# EAGLE design Hreidmar (EAGLE 5.10)
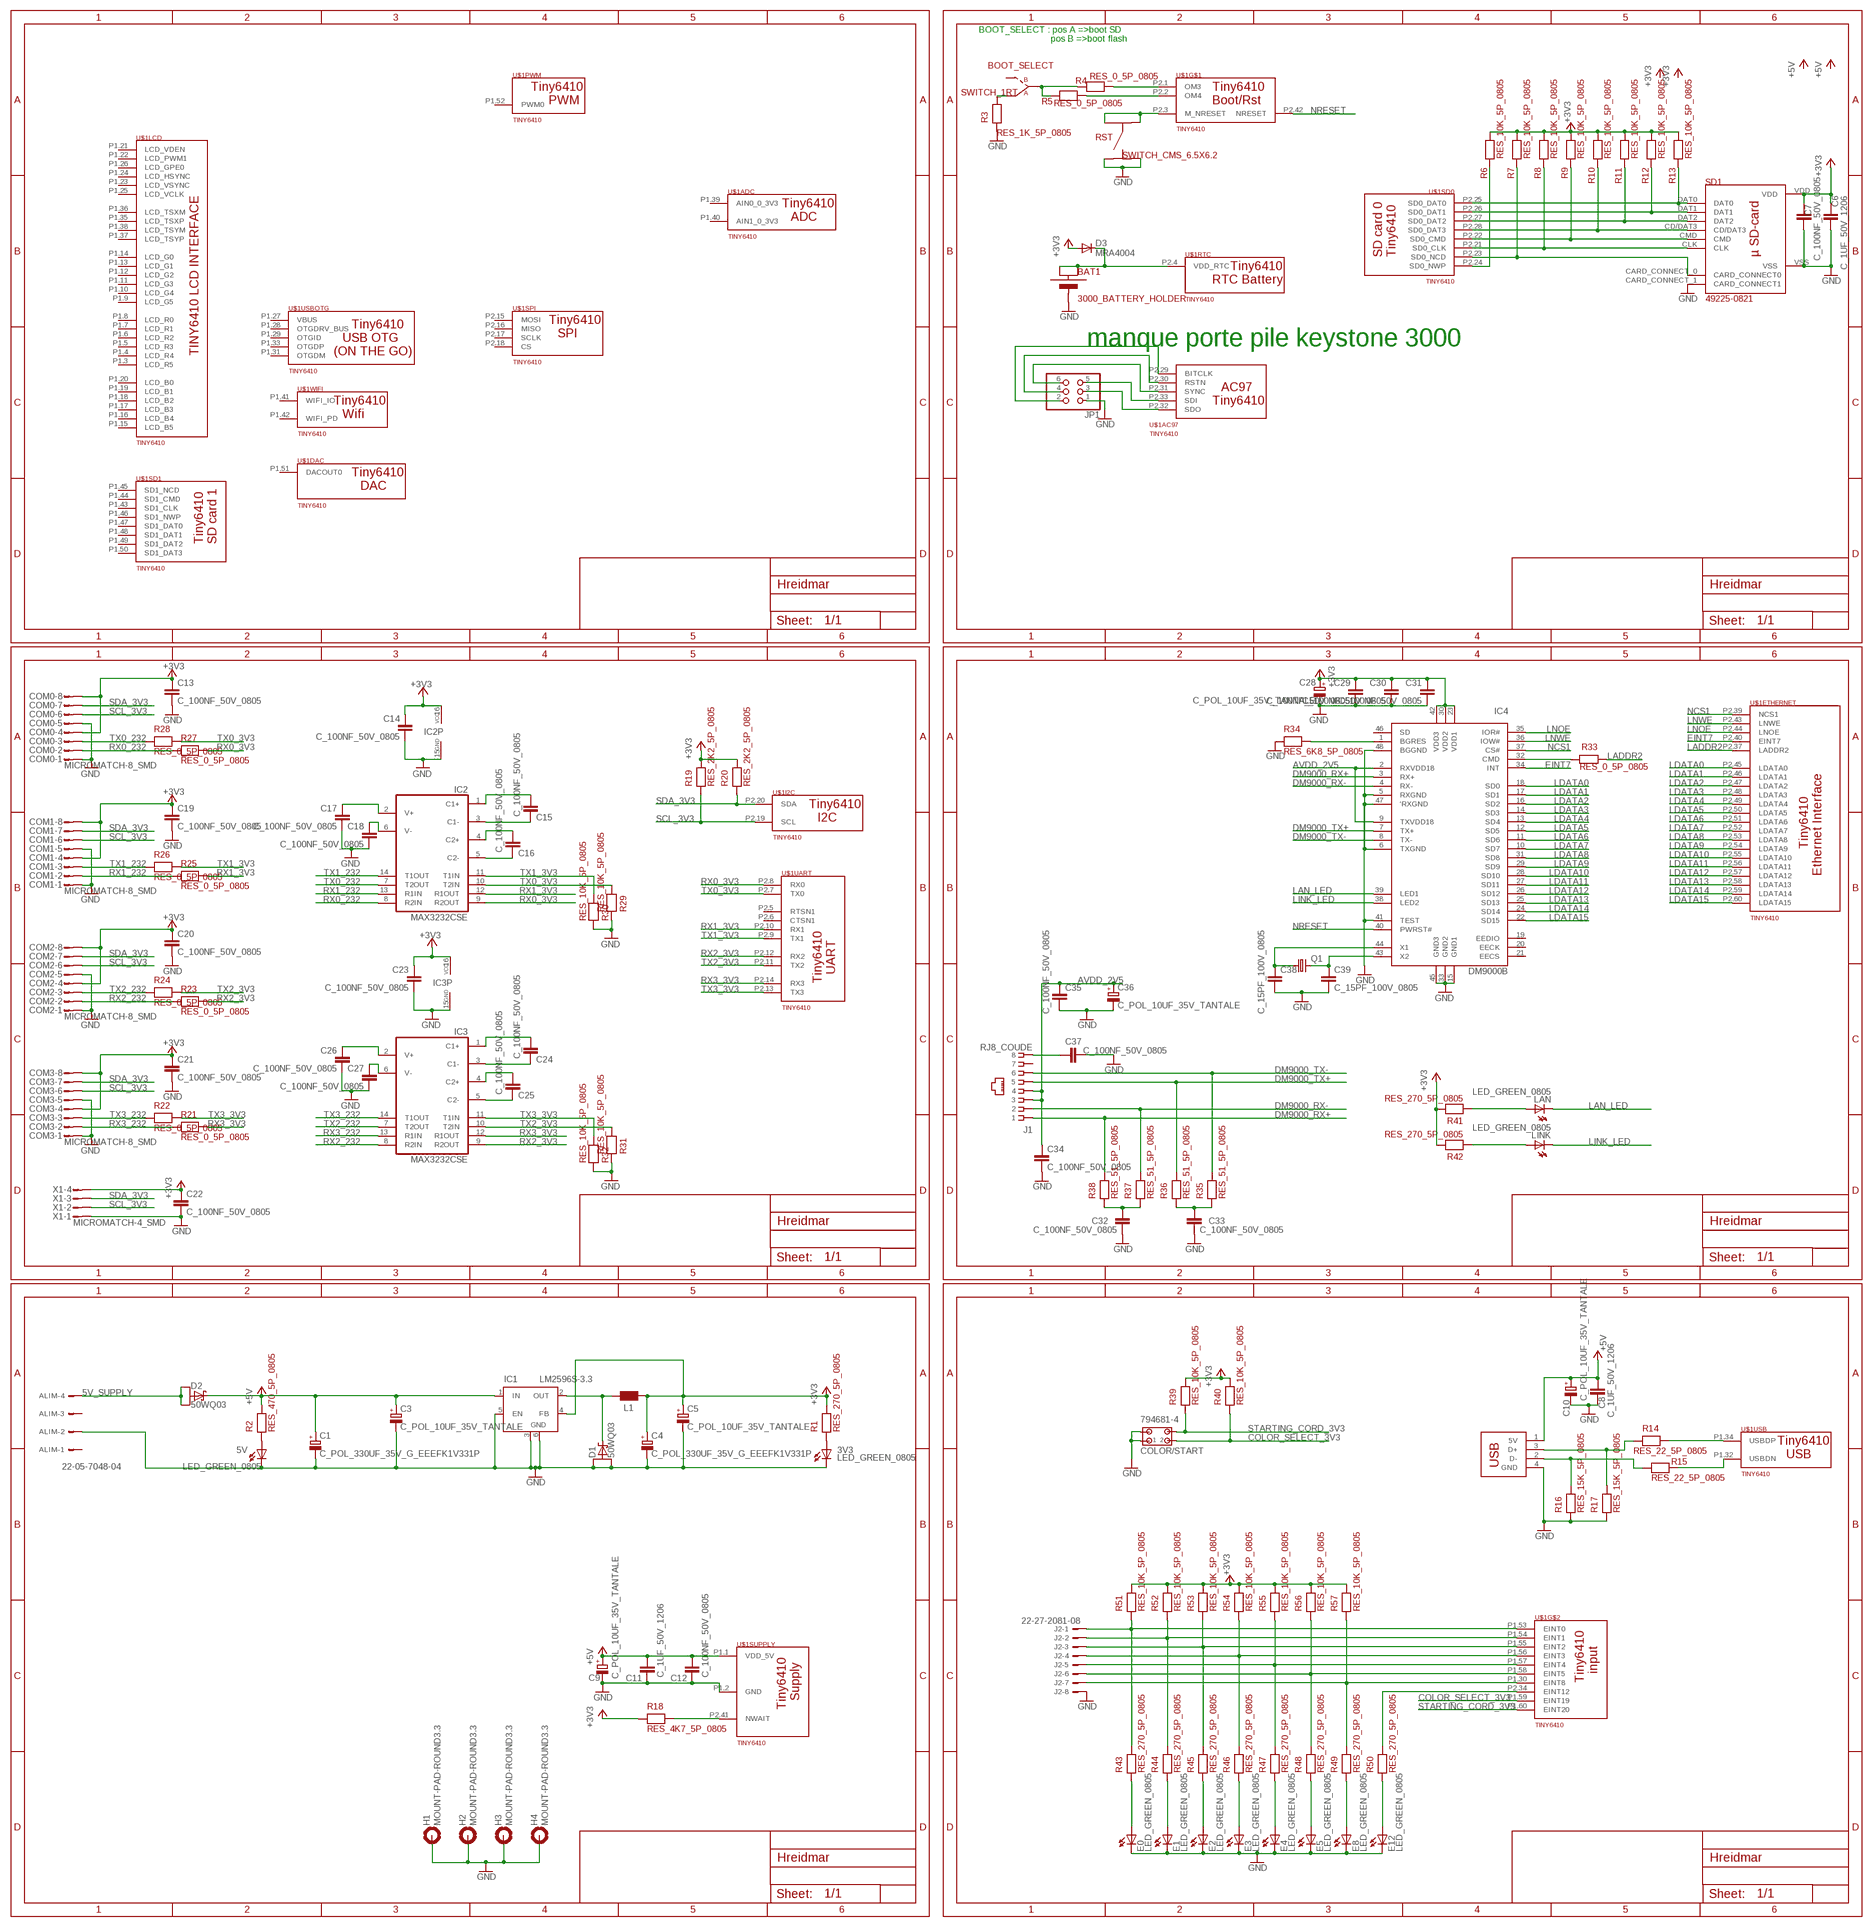
[diagram p0: schematic, sheet 1]

## Parts
3V3  LED_GREEN_0805  [CHIP-LED0805]
5V  LED_GREEN_0805  [CHIP-LED0805]
ALIM  22-05-7048-04  [7395-04]
BAT1  3000_BATTERY_HOLDER  [3000_BATTERY]
BOOT_SELECT  SWITCH_1RT  [SWITCH_1RT]
C1  C_POL_330UF_35V_G_EEEFK1V331P  [PANASONIC_G]
C3  C_POL_10UF_35V_TANTALE  [SMC_D]
C4  C_POL_330UF_35V_G_EEEFK1V331P  [PANASONIC_G]
C5  C_POL_10UF_35V_TANTALE  [SMC_D]
C6  C_1UF_50V_1206  [C1206]
C7  C_100NF_50V_0805  [C0805]
C8  C_1UF_50V_1206  [C1206]
C9  C_POL_10UF_35V_TANTALE  [SMC_D]
C10  C_POL_10UF_35V_TANTALE  [SMC_D]
C11  C_1UF_50V_1206  [C1206]
C12  C_100NF_50V_0805  [C0805]
C13  C_100NF_50V_0805  [C0805]
C14  C_100NF_50V_0805  [C0805]
C15  C_100NF_50V_0805  [C0805]
C16  C_100NF_50V_0805  [C0805]
C17  C_100NF_50V_0805  [C0805]
C18  C_100NF_50V_0805  [C0805]
C19  C_100NF_50V_0805  [C0805]
C20  C_100NF_50V_0805  [C0805]
C21  C_100NF_50V_0805  [C0805]
C22  C_100NF_50V_0805  [C0805]
C23  C_100NF_50V_0805  [C0805]
C24  C_100NF_50V_0805  [C0805]
C25  C_100NF_50V_0805  [C0805]
C26  C_100NF_50V_0805  [C0805]
C27  C_100NF_50V_0805  [C0805]
C28  C_POL_10UF_35V_TANTALE  [SMC_D]
C29  C_100NF_50V_0805  [C0805]
C30  C_100NF_50V_0805  [C0805]
C31  C_100NF_50V_0805  [C0805]
C32  C_100NF_50V_0805  [C0805]
C33  C_100NF_50V_0805  [C0805]
C34  C_100NF_50V_0805  [C0805]
C35  C_100NF_50V_0805  [C0805]
C36  C_POL_10UF_35V_TANTALE  [SMC_D]
C37  C_100NF_50V_0805  [C0805]
C38  C_15PF_100V_0805  [C0805]
C39  C_15PF_100V_0805  [C0805]
COLOR/START  794681-4  [794681-4]
COM0  MICROMATCH-8_SMD  [MICROMATCH-8_SMD]
COM1  MICROMATCH-8_SMD  [MICROMATCH-8_SMD]
COM2  MICROMATCH-8_SMD  [MICROMATCH-8_SMD]
COM3  MICROMATCH-8_SMD  [MICROMATCH-8_SMD]
D1  50WQ03  [TO252]
D2  50WQ03  [TO252]
D3  MRA4004  DIODE-DO-214AC  [DO-214AC]
E0  LED_GREEN_0805  [CHIP-LED0805]
E1  LED_GREEN_0805  [CHIP-LED0805]
E2  LED_GREEN_0805  [CHIP-LED0805]
E3  LED_GREEN_0805  [CHIP-LED0805]
E4  LED_GREEN_0805  [CHIP-LED0805]
E5  LED_GREEN_0805  [CHIP-LED0805]
E8  LED_GREEN_0805  [CHIP-LED0805]
E12  LED_GREEN_0805  [CHIP-LED0805]
H1  MOUNT-PAD-ROUND3.3  [3,3-PAD]
H2  MOUNT-PAD-ROUND3.3  [3,3-PAD]
H3  MOUNT-PAD-ROUND3.3  [3,3-PAD]
H4  MOUNT-PAD-ROUND3.3  [3,3-PAD]
IC1  LM2596S-3.3  [TO263-5]
IC2  MAX3232CSE  [SO16]
IC3  MAX3232CSE  [SO16]
IC4  DM9000B  [TQFP48]
J1  RJ8_COUDE  [6605759-1]
J2  22-27-2081-08  [6410-08]
JP1  PINHD-2X3  [2X03]
L1  L_22UH_XXL_7447709220  [WE-PD_L/XL/XXL]
LAN  LED_GREEN_0805  [CHIP-LED0805]
LINK  LED_GREEN_0805  [CHIP-LED0805]
Q1  CRYSTAL_25MHZ_HC49UP  [HC49UP]
R1  RES_270_5P_0805  [R0805]
R2  RES_470_5P_0805  [R0805]
R3  RES_1K_5P_0805  [R0805]
R4  RES_0_5P_0805  [R0805]
R5  RES_0_5P_0805  [R0805]
R6  RES_10K_5P_0805  [R0805]
R7  RES_10K_5P_0805  [R0805]
R8  RES_10K_5P_0805  [R0805]
R9  RES_10K_5P_0805  [R0805]
R10  RES_10K_5P_0805  [R0805]
R11  RES_10K_5P_0805  [R0805]
R12  RES_10K_5P_0805  [R0805]
R13  RES_10K_5P_0805  [R0805]
R14  RES_22_5P_0805  [R0805]
R15  RES_22_5P_0805  [R0805]
R16  RES_15K_5P_0805  [R0805]
R17  RES_15K_5P_0805  [R0805]
R18  RES_4K7_5P_0805  [R0603]
R19  RES_2K2_5P_0805  [R0805]
R20  RES_2K2_5P_0805  [R0805]
R21  RES_0_5P_0805  [R0805]
R22  RES_0_5P_0805  [R0805]
R23  RES_0_5P_0805  [R0805]
R24  RES_0_5P_0805  [R0805]
R25  RES_0_5P_0805  [R0805]
R26  RES_0_5P_0805  [R0805]
R27  RES_0_5P_0805  [R0805]
R28  RES_0_5P_0805  [R0805]
R29  RES_10K_5P_0805  [R0805]
R30  RES_10K_5P_0805  [R0805]
R31  RES_10K_5P_0805  [R0805]
R32  RES_10K_5P_0805  [R0805]
R33  RES_0_5P_0805  [R0805]
R34  RES_6K8_5P_0805  [R0805]
R35  RES_51_5P_0805  [R0805]
R36  RES_51_5P_0805  [R0805]
R37  RES_51_5P_0805  [R0805]
R38  RES_51_5P_0805  [R0805]
R39  RES_10K_5P_0805  [R0805]
R40  RES_10K_5P_0805  [R0805]
R41  RES_270_5P_0805  [R0805]
R42  RES_270_5P_0805  [R0805]
R43  RES_270_5P_0805  [R0805]
R44  RES_270_5P_0805  [R0805]
R45  RES_270_5P_0805  [R0805]
R46  RES_270_5P_0805  [R0805]
R47  RES_270_5P_0805  [R0805]
R48  RES_270_5P_0805  [R0805]
R49  RES_270_5P_0805  [R0805]
R50  RES_270_5P_0805  [R0805]
R51  RES_10K_5P_0805  [R0805]
R52  RES_10K_5P_0805  [R0805]
R53  RES_10K_5P_0805  [R0805]
R54  RES_10K_5P_0805  [R0805]
R55  RES_10K_5P_0805  [R0805]
R56  RES_10K_5P_0805  [R0805]
R57  RES_10K_5P_0805  [R0805]
RST  SWITCH_CMS_6.5X6.2  [SWITCH_B3SL]
SD1  49225-0821  [49225-0821]
U$1  TINY6410  [TINY6410]
U$2  USB_A  [USB_A_RIGHT_ANGLE]
X1  MICROMATCH-4_SMD  [MICROMATCH-4_SMD]

## Nets
5V_SUPPLY: ALIM.4 D2.1(A1) D2.3(A2)
+3V3: C4.+ C5.+ C6.1 C7.1 C13.1 C14.1 C19.1 C20.1 C21.1 C22.1 C23.1 C28.+ C29.1 C30.1 C31.1 COM0.4 COM0.8 COM1.4 COM1.8 COM2.4 COM2.8 COM3.4 COM3.8 D3.A IC1.4(FB) IC2.16(VCC) IC3.16(VCC) IC4.23(VDD1) IC4.30(VDD2) IC4.42(VDD3) L1.2 R1.2 R6.2 R7.2 R8.2 R9.2 R10.2 R11.2 R12.2 R13.2 R18.1 R19.2 R20.2 R39.2 R40.2 R41.2 R42.2 R51.2 R52.2 R53.2 R54.2 R55.2 R56.2 R57.2 SD1.VDD X1.4
+5V: C1.+ C3.+ C8.1 C9.+ C10.+ C11.1 C12.1 D2.4(C) IC1.1(IN) R2.2 U$1.P1.1(SUPPLY:VDD_5V) U$2.1(5V)
AVDD_2V5: C34.1 C35.1 C36.+ IC4.2(RXVDD18) IC4.9(TXVDD18) J1.3 J1.4
COLOR_SELECT_3V3: COLOR/START.2 R40.1 U$1.P1.59(EINT19)
DM9000_RX+: IC4.3(RX+) J1.1 R38.2
DM9000_RX-: IC4.4(RX-) J1.2 R37.2
DM9000_TX+: IC4.7(TX+) J1.5 R36.2
DM9000_TX-: IC4.8(TX-) J1.6 R35.2
EINT7: IC4.34(INT) U$1.P2.40(ETHERNET:EINT7)
GND: 3V3.C 5V.C ALIM.2 BAT1.- C1.- C3.- C4.- C5.- C6.2 C7.2 C8.2 C9.- C10.- C11.2 C12.2 C13.2 C14.2 C17.2 C18.2 C19.2 C20.2 C21.2 C22.2 C23.2 C26.2 C27.2 C28.- C29.2 C30.2 C31.2 C32.2 C33.2 C34.2 C35.2 C36.- C37.2 C38.2 C39.2 COLOR/START.1 COLOR/START.3 COM0.1 COM0.5 COM1.1 COM1.5 COM2.1 COM2.5 COM3.1 COM3.5 D1.1(A1) D1.3(A2) E0.C E1.C E2.C E3.C E4.C E5.C E8.C E12.C H1.B3,3(MOUNT) H2.B3,3(MOUNT) H3.B3,3(MOUNT) H4.B3,3(MOUNT) IC1.3(GND) IC1.5(EN) IC1.6(GND) IC2.15(GND) IC3.15(GND) IC4.5(RXGND) IC4.6(TXGND) IC4.15(GND1) IC4.33(GND2) IC4.41(TEST) IC4.45(GND3) IC4.47('RXGND) IC4.48(BGGND) J2.8 JP1.1 R3.1 R16.1 R17.1 R29.1 R30.1 R31.1 R32.1 R34.1 RST.1 RST.2 SD1.CARD_CONNECT_1(CARD_CONNECT1) SD1.VSS U$1.P1.2(SUPPLY:GND) U$2.4(GND) X1.1
LADDR2: R33.1 U$1.P2.37(ETHERNET:LADDR2)
LAN_LED: IC4.39(LED1) LAN.C
LDATA0: IC4.18(SD0) U$1.P2.45(ETHERNET:LDATA0)
LDATA1: IC4.17(SD1) U$1.P2.46(ETHERNET:LDATA1)
LDATA2: IC4.16(SD2) U$1.P2.47(ETHERNET:LDATA2)
LDATA3: IC4.14(SD3) U$1.P2.48(ETHERNET:LDATA3)
LDATA4: IC4.13(SD4) U$1.P2.49(ETHERNET:LDATA4)
LDATA5: IC4.12(SD5) U$1.P2.50(ETHERNET:LDATA5)
LDATA6: IC4.11(SD6) U$1.P2.51(ETHERNET:LDATA6)
LDATA7: IC4.10(SD7) U$1.P2.52(ETHERNET:LDATA7)
LDATA8: IC4.31(SD8) U$1.P2.53(ETHERNET:LDATA8)
LDATA9: IC4.29(SD9) U$1.P2.54(ETHERNET:LDATA9)
LDATA10: IC4.28(SD10) U$1.P2.55(ETHERNET:LDATA10)
LDATA11: IC4.27(SD11) U$1.P2.56(ETHERNET:LDATA11)
LDATA12: IC4.26(SD12) U$1.P2.57(ETHERNET:LDATA12)
LDATA13: IC4.25(SD13) U$1.P2.58(ETHERNET:LDATA13)
LDATA14: IC4.24(SD14) U$1.P2.59(ETHERNET:LDATA14)
LDATA15: IC4.22(SD15) U$1.P2.60(ETHERNET:LDATA15)
LINK_LED: IC4.38(LED2) LINK.C
LNOE: IC4.35(IOR#) U$1.P2.44(ETHERNET:LNOE)
LNWE: IC4.36(IOW#) U$1.P2.43(ETHERNET:LNWE)
N$1: RST.3 RST.4 U$1.P2.3(M_NRESET)
N$2: 3V3.A R1.1
N$3: 5V.A R2.1
N$4: BOOT_SELECT.3 R3.2
N$5: R5.2 U$1.P2.2(OM4)
N$6: R4.2 U$1.P2.1(OM3)
N$7: BOOT_SELECT.1 R4.1 R5.1
N$8: R13.1 SD1.DAT0 U$1.P2.25(SD0:SD0_DAT0)
N$9: R12.1 SD1.DAT1 U$1.P2.26(SD0:SD0_DAT1)
N$10: D1.4(C) IC1.2(OUT) L1.1
N$11: R11.1 SD1.DAT2 U$1.P2.27(SD0:SD0_DAT2)
N$12: R10.1 SD1.CD/DAT3 U$1.P2.28(SD0:SD0_DAT3)
N$13: R9.1 SD1.CMD U$1.P2.22(SD0:SD0_CMD)
N$14: R8.1 SD1.CLK U$1.P2.21(SD0:SD0_CLK)
N$15: R7.1 SD1.CARD_CONNECT_0(CARD_CONNECT0) U$1.P2.23(SD0:SD0_NCD)
N$16: R6.1 U$1.P2.24(SD0:SD0_NWP)
N$17: R15.1 R16.2 U$2.2(D-)
N$18: R14.1 R17.2 U$2.3(D+)
N$19: R14.2 U$1.P1.34(USB:USBDP)
N$20: C15.1 IC2.1(C1+)
N$21: R18.2 U$1.P2.41(SUPPLY:NWAIT)
N$22: C15.2 IC2.3(C1-)
N$23: C16.1 IC2.4(C2+)
N$24: C16.2 IC2.5(C2-)
N$25: C18.1 IC2.6(V-)
N$26: C17.1 IC2.2(V+)
N$27: C24.1 IC3.1(C1+)
N$28: C24.2 IC3.3(C1-)
N$29: C25.1 IC3.4(C2+)
N$30: C25.2 IC3.5(C2-)
N$31: C26.1 IC3.2(V+)
N$32: C27.1 IC3.6(V-)
N$33: IC4.32(CMD) R33.2
N$34: IC4.1(BGRES) R34.2
N$35: C32.1 R37.1 R38.1
N$36: C33.1 R35.1 R36.1
N$37: C39.1 IC4.43(X2) Q1.2
N$38: C38.1 IC4.44(X1) Q1.1
N$39: LAN.A R41.1
N$40: LINK.A R42.1
N$41: JP1.3 U$1.P2.32(AC97:SDO)
N$42: C37.1 J1.8
N$43: BAT1.'+ BAT1.+ D3.C U$1.P2.4(RTC:VDD_RTC)
N$44: E0.A R43.1
N$45: E1.A R44.1
N$46: E2.A R45.1
N$47: E3.A R46.1
N$48: E4.A R47.1
N$49: E5.A R48.1
N$50: E8.A R49.1
N$51: E12.A R50.1
N$52: R50.2 U$1.P2.34(EINT12)
N$53: J2.7 R49.2 R57.1 U$1.P1.30(EINT8)
N$54: J2.6 R48.2 R56.1 U$1.P1.58(EINT5)
N$55: J2.5 R47.2 R55.1 U$1.P1.57(EINT4)
N$56: J2.4 R46.2 R54.1 U$1.P1.56(EINT3)
N$57: J2.3 R45.2 R53.1 U$1.P1.55(EINT2)
N$58: J2.2 R44.2 R52.1 U$1.P1.54(EINT1)
N$59: J2.1 R43.2 R51.1 U$1.P1.53(EINT0)
N$60: JP1.5 U$1.P2.33(AC97:SDI)
N$61: JP1.6 U$1.P2.31(AC97:SYNC)
N$62: JP1.4 U$1.P2.30(AC97:RSTN)
N$63: JP1.2 U$1.P2.29(AC97:BITCLK)
NCS1: IC4.37(CS#) U$1.P2.39(ETHERNET:NCS1)
NRESET: IC4.40(PWRST#) U$1.P2.42(NRESET)
RX0_3V3: IC2.9(R2OUT) R27.2 U$1.P2.8(UART:RX0)
RX0_232: COM0.2 IC2.8(R2IN) R27.1
RX1_3V3: IC2.12(R1OUT) R25.2 U$1.P2.10(UART:RX1)
RX1_232: COM1.2 IC2.13(R1IN) R25.1
RX2_3V3: IC3.9(R2OUT) R23.2 U$1.P2.12(UART:RX2)
RX2_232: COM2.2 IC3.8(R2IN) R23.1
RX3_3V3: IC3.12(R1OUT) R21.2 U$1.P2.14(UART:RX3)
RX3_232: COM3.2 IC3.13(R1IN) R21.1
SCL_3V3: COM0.6 COM1.6 COM2.6 COM3.6 R19.1 U$1.P2.19(I2C:SCL) X1.2
SDA_3V3: COM0.7 COM1.7 COM2.7 COM3.7 R20.1 U$1.P2.20(I2C:SDA) X1.3
STARTING_CORD_3V3: COLOR/START.4 R39.1 U$1.P1.60(EINT20)
TX0_3V3: IC2.10(T2IN) R28.2 R29.2 U$1.P2.7(UART:TX0)
TX0_232: COM0.3 IC2.7(T2OUT) R28.1
TX1_3V3: IC2.11(T1IN) R26.2 R30.2 U$1.P2.9(UART:TX1)
TX1_232: COM1.3 IC2.14(T1OUT) R26.1
TX2_3V3: IC3.10(T2IN) R24.2 R31.2 U$1.P2.11(UART:TX2)
TX2_232: COM2.3 IC3.7(T2OUT) R24.1
TX3_3V3: IC3.11(T1IN) R22.2 R32.2 U$1.P2.13(UART:TX3)
TX3_232: COM3.3 IC3.14(T1OUT) R22.1
USBDN: R15.2 U$1.P1.32(USB:USBDN)
Unconnected: ALIM.1 ALIM.3 BOOT_SELECT.2 IC4.19(EEDIO) IC4.20(EECK) IC4.21(EECS) IC4.46(SD) J1.7 U$1.P1.3(LCD:LCD_R5) U$1.P1.4(LCD:LCD_R4) U$1.P1.5(LCD:LCD_R3) U$1.P1.6(LCD:LCD_R2) U$1.P1.7(LCD:LCD_R1) U$1.P1.8(LCD:LCD_R0) U$1.P1.9(LCD:LCD_G5) U$1.P1.10(LCD:LCD_G4) U$1.P1.11(LCD:LCD_G3) U$1.P1.12(LCD:LCD_G2) U$1.P1.13(LCD:LCD_G1) U$1.P1.14(LCD:LCD_G0) U$1.P1.15(LCD:LCD_B5) U$1.P1.16(LCD:LCD_B4) U$1.P1.17(LCD:LCD_B3) U$1.P1.18(LCD:LCD_B2) U$1.P1.19(LCD:LCD_B1) U$1.P1.20(LCD:LCD_B0) U$1.P1.21(LCD:LCD_VDEN) U$1.P1.22(LCD:LCD_PWM1) U$1.P1.23(LCD:LCD_VSYNC) U$1.P1.24(LCD:LCD_HSYNC) U$1.P1.25(LCD:LCD_VCLK) U$1.P1.26(LCD:LCD_GPE0) U$1.P1.27(USBOTG:VBUS) U$1.P1.28(USBOTG:OTGDRV_BUS) U$1.P1.29(USBOTG:OTGID) U$1.P1.31(USBOTG:OTGDM) U$1.P1.33(USBOTG:OTGDP) U$1.P1.35(LCD:LCD_TSXP) U$1.P1.36(LCD:LCD_TSXM) U$1.P1.37(LCD:LCD_TSYP) U$1.P1.38(LCD:LCD_TSYM) U$1.P1.39(ADC:AIN0_0_3V3) U$1.P1.40(ADC:AIN1_0_3V3) U$1.P1.41(WIFI:WIFI_IO) U$1.P1.42(WIFI:WIFI_PD) U$1.P1.43(SD1:SD1_CLK) U$1.P1.44(SD1:SD1_CMD) U$1.P1.45(SD1:SD1_NCD) U$1.P1.46(SD1:SD1_NWP) U$1.P1.47(SD1:SD1_DAT0) U$1.P1.48(SD1:SD1_DAT1) U$1.P1.49(SD1:SD1_DAT2) U$1.P1.50(SD1:SD1_DAT3) U$1.P1.51(DAC:DACOUT0) U$1.P1.52(PWM:PWM0) U$1.P2.5(UART:RTSN1) U$1.P2.6(UART:CTSN1) U$1.P2.15(SPI:MOSI) U$1.P2.16(SPI:MISO) U$1.P2.17(SPI:SCLK) U$1.P2.18(SPI:CS)

## Notes on the sheet
- BOOT_SELECT : pos A =>boot SD
- pos B =>boot flash
- manque porte pile keystone 3000

## Library data of the parts
3V3 5V E0 E1-E5 E8 E12 LAN LINK = robotter_diode:LED_
ALIM = con-molex:22-?-04: CONNECTOR wire to board 2.54 mm (.1 inch) pitch header
BAT1 = robotter_others:3000_BATTERY_HOLDER
BOOT_SELECT = robotter_others:SWITCH_1RT
C1 C4 = robotter_capacitor:C_POL_; VALUE: 330UF_35V_G_EEEFK1V331P
C3 C5 C9 C10 C28 C36 = robotter_capacitor:C_POL_; VALUE: 10uF_35V_TANTALE
C6-C8 C11-C27 C29-C35 C37-C39 = robotter_capacitor:C_
COLOR/START = con-amp:794681-4: Micro MATE-N-LOK Connectors grid 1.5mm Dual Row Through Hole Vertical Metal Through Hole Holddowns Source: ENG_CD_794681_E.pdf
COM0 COM1-COM3 = robotter_connector:MICROMATCH-8_SMD: Ref FN : 1865096
D1 D2 = robotter_diode:50WQ03
D3 = diode:DIODE-: DIODE
H1-H4 = holes:MOUNT-PAD-ROUND: MOUNTING PAD, round
IC1 = robotter_ic:LM2596S: STEP-DOWN VOLTAGE REGULATOR
IC2 IC3 = robotter_ic:MAX3232: True RS-232 Transceivers 3.0V to 5.5V, Low-Power up to 1Mbps, Using Four 0.1µF External Capacitors Source: http://pdfserv.maxim-ic.com/en/ds/MAX3222-MAX3241.pdf
IC4 = robotter_ic:DM9000B: MAC/PHY Ethernet 10/100 16bits mode pinout
J1 = robotter_connector:RJ8_COUDE
J2 = con-molex:22-?-08: CONNECTOR wire to board 2.54 mm (.1 inch) pitch header
JP1 = pinhead:PINHD-2X3: PIN HEADER
L1 = robotter_inductor:L_: SMD-Shielded Power Inductors WE-PD Is recommended for the application with switching regulators from National Semiconductor, Linear Technology, Texas Instruments and Fairchild Semiconductor - Magnetically shielded version which results in a low leakage field - High storage capacity - Low self-losses -- Switching regulators with low operating voltages (computer, laptop, mobile phones, pagers) -- Integrated DC/DC-converter; VALUE: 22UH_XXL_7447709220
Q1 = robotter_ic:CRYSTAL_: CRYSTAL
R1-R57 = robotter_resistor:RES_
RST = robotter_others:SWITCH_CMS_6.5X6.2
SD1 = robotter_connector:49225-0821
U$1 = robotter_others:TINY6410
U$2 = robotter_connector:USB_A
X1 = robotter_connector:MICROMATCH-4_SMD: Ref FN : 1865094

## Board
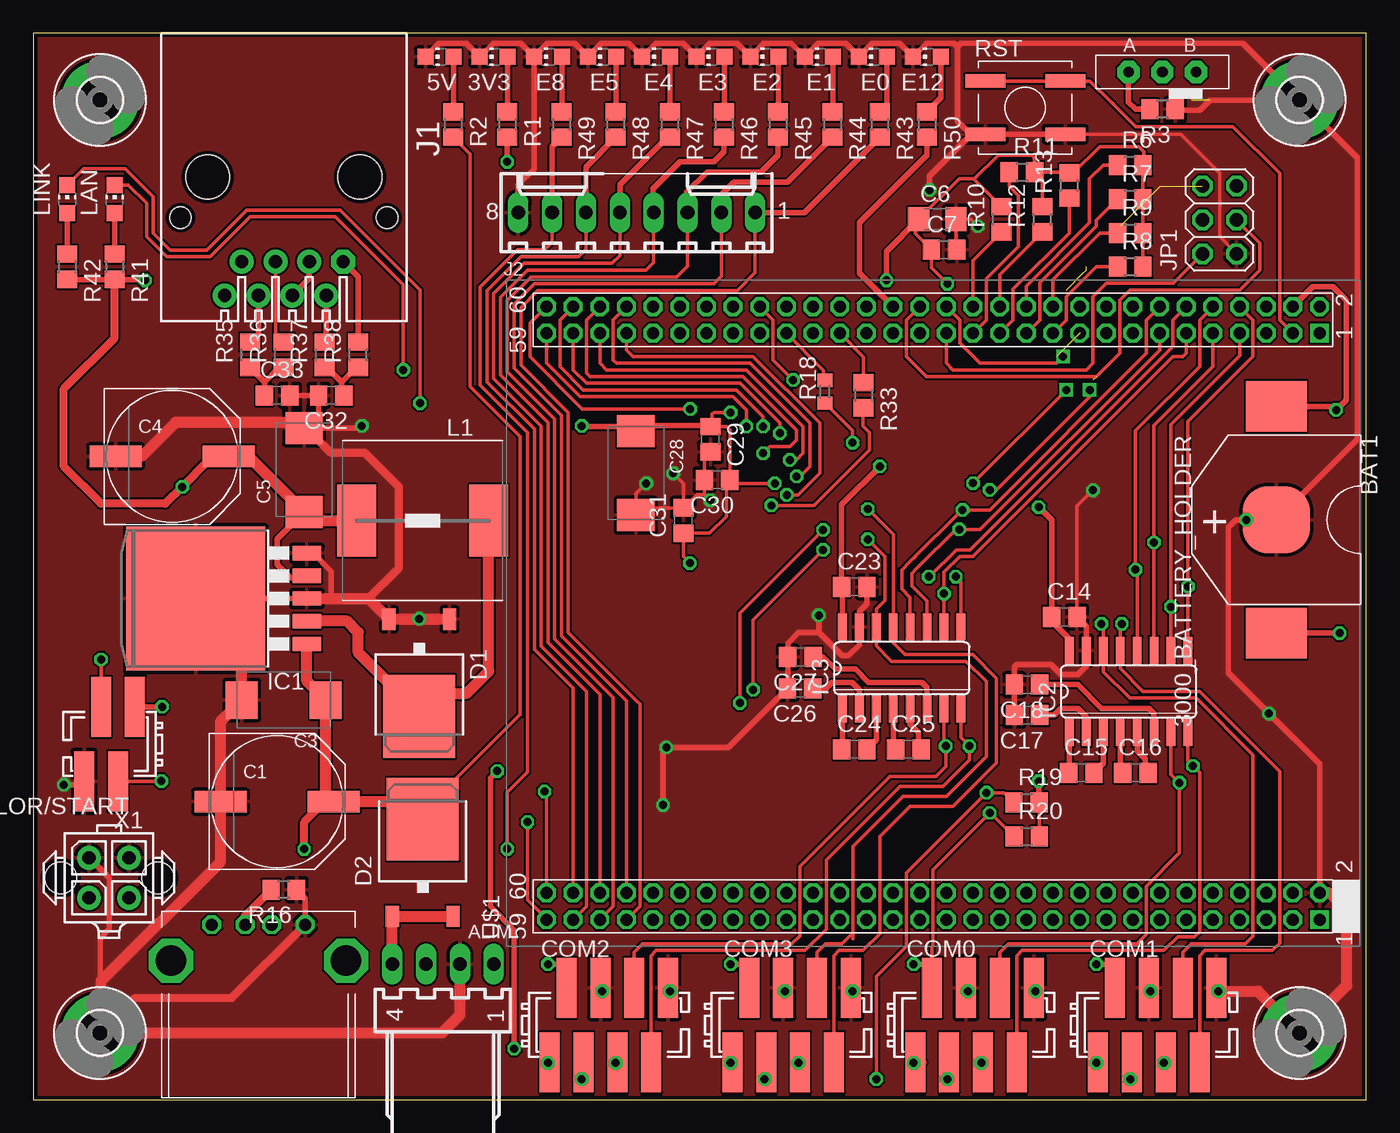
[diagram p1: board, top side]
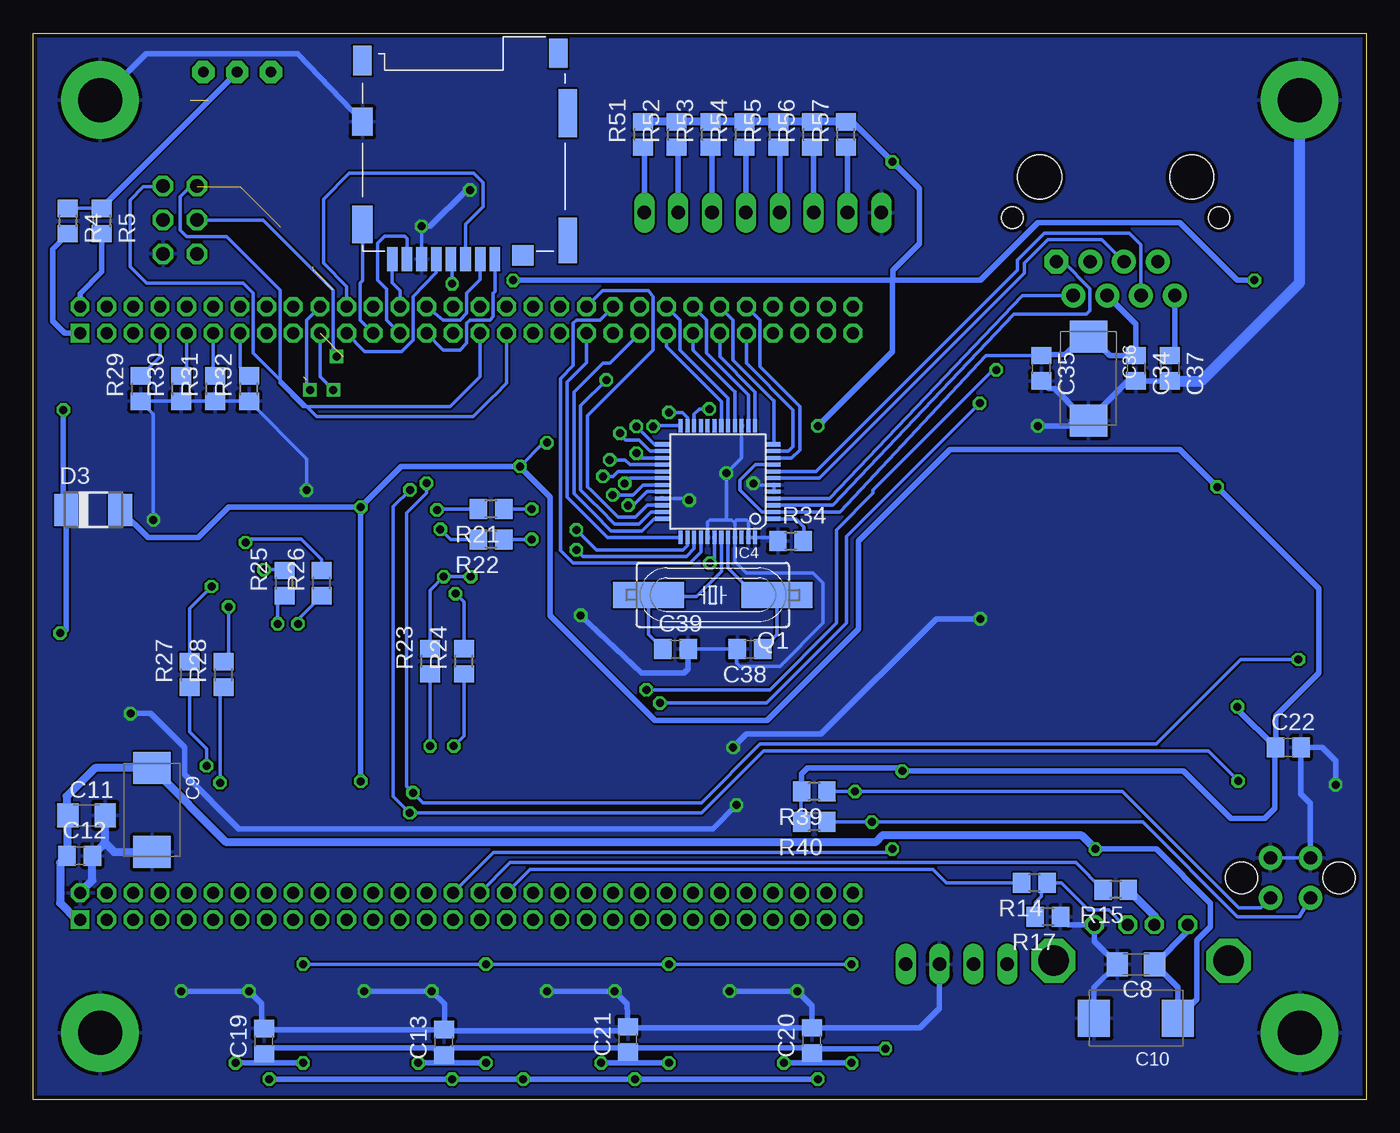
[diagram p2: board, bottom side, seen from below]

Size 100 x 80 mm. Coordinates in mm from the lower left corner, seen from the top.
Outline: 0,0 100,0 100,80 0,80 0,0
Copper layers (1*16): Top 0.035mm / dielectric 1.5mm / Bottom 0.035mm
Design rules "default *": minimum track width 10mil, minimum drill 0.3mm, track to track 0.15mm, track to pad 0.15mm, pad to pad 0.15mm, via to via 0.15mm, smd to smd 8mil, copper to edge 0.3mm, drill to drill 8mil, minimum pad ring 10mil, minimum via ring 8mil, stop-mask expansion 4mil, vias tented up to drill 0mil, thermal gap 10mil

### Footprints (pad centres in the part's own frame; a part is rotated, then mirrored left to right if it is on the bottom)
CHIP-LED0805 = smd 1.2 x 1.2: A 0,-1.05; C 0,1.05
7395-04 = drill 1.016 long: 1 3.81,0; 2 1.27,0; 3 -1.27,0; 4 -3.81,0
3000_BATTERY = smd 3.81 x 4.572: '+ -8.509,0; + 8.509,0 | smd 5.08 x 5.08: - 0,0
SWITCH_1RT = drill 0.8 pad 1.676 octagon: 1 0,0; 2 -2.54,0; 3 2.54,0
PANASONIC_G = smd 3.9 x 1.6: + 4.25,0; - -4.25,0
SMC_D = smd 2.4 x 2.8: + -3.15,0; - 3.15,0
C1206 = smd 1.6 x 1.8: 1 -1.4,0; 2 1.4,0
C0805 = smd 1.3 x 1.5: 1 -0.95,0; 2 0.95,0
794681-4 = drill 1 pad 1.778 round: 1 1.5,-1.5; 2 1.5,1.5; 3 -1.5,-1.5; 4 -1.5,1.5 | hole 2.4: 3.63,0; -3.67,0
MICROMATCH-8_SMD = smd 1.5 x 4.5: 1 4.445,2.794; 2 3.175,-2.794; 3 1.905,2.794; 4 0.635,-2.794; 5 -0.635,2.794; 6 -1.905,-2.794; 7 -3.175,2.794; 8 -4.445,-2.794
TO252 = smd 1 x 1.6: 1 -2.28,-4.8; 3 2.28,-4.8 | smd 5.4 x 6.2: 4 0,2.5
DO-214AC = smd 1.8 x 2.4: A 2.025,0; C -2.025,0
3,3-PAD = drill 3.3 pad 5.842 round: B3,3 0,0
TO263-5 = smd 1.067 x 2.159: 1 -3.404,-5.791; 2 -1.702,-5.791; 3 0,-5.791; 4 1.702,-5.791; 5 3.404,-5.791 | smd 10.8 x 10.41: 6 0,2.54
SO16 = smd 0.66 x 2.032: 1 -4.445,-3.073; 2 -3.175,-3.073; 3 -1.905,-3.073; 4 -0.635,-3.073; 5 0.635,-3.073; 6 1.905,-3.073; 7 3.175,-3.073; 8 4.445,-3.073; 9 4.445,3.073; 10 3.175,3.073; 11 1.905,3.073; 12 0.635,3.073; 13 -0.635,3.073; 14 -1.905,3.073; 15 -3.175,3.073; 16 -4.445,3.073
TQFP48 = smd 1.016 x 0.305: 1 -4.191,2.794; 2 -4.191,2.286; 3 -4.191,1.778; 4 -4.191,1.27; 5 -4.191,0.762; 6 -4.191,0.254; 7 -4.191,-0.254; 8 -4.191,-0.762; 9 -4.191,-1.27; 10 -4.191,-1.778; 11 -4.191,-2.286; 12 -4.191,-2.794; 25 4.191,-2.794; 26 4.191,-2.286; 27 4.191,-1.778; 28 4.191,-1.27; 29 4.191,-0.762; 30 4.191,-0.254; 31 4.191,0.254; 32 4.191,0.762; 33 4.191,1.27; 34 4.191,1.778; 35 4.191,2.286; 36 4.191,2.794 | smd 0.305 x 1.016: 13 -2.794,-4.191; 14 -2.286,-4.191; 15 -1.778,-4.191; 16 -1.27,-4.191; 17 -0.762,-4.191; 18 -0.254,-4.191; 19 0.254,-4.191; 20 0.762,-4.191; 21 1.27,-4.191; 22 1.778,-4.191; 23 2.286,-4.191; 24 2.794,-4.191; 37 2.794,4.191; 38 2.286,4.191; 39 1.778,4.191; 40 1.27,4.191; 41 0.762,4.191; 42 0.254,4.191; 43 -0.254,4.191; 44 -0.762,4.191; 45 -1.27,4.191; 46 -1.778,4.191; 47 -2.286,4.191; 48 -2.794,4.191
6605759-1 = drill 1 pad 1.8 octagon: 1 -4.45,6.35 | drill 1 pad 1.8 round: 2 -3.18,8.89; 3 -1.91,6.35; 4 -0.63,8.89; 5 0.63,6.35; 6 1.9,8.89; 7 3.17,6.35; 8 4.44,8.89 | hole 3.3: -5.715,0; 5.715,0 | hole 1.6: -7.747,3.048; 7.747,3.048
6410-08 = drill 1.016 long: 1 8.89,0; 2 6.35,0; 3 3.81,0; 4 1.27,0; 5 -1.27,0; 6 -3.81,0; 7 -6.35,0; 8 -8.89,0
2X03 = drill 1.016 octagon: 1 -2.54,-1.27; 2 -2.54,1.27; 3 0,-1.27; 4 0,1.27; 5 2.54,-1.27; 6 2.54,1.27
WE-PD_L/XL/XXL = smd 2.9 x 5.4: 1 -4.95,0; 2 4.95,0
HC49UP = smd 5.334 x 1.93: 1 -4.826,0; 2 4.826,0
R0805 = smd 1.3 x 1.5: 1 -0.95,0; 2 0.95,0
R0603 = smd 1 x 1.1: 1 -0.85,0; 2 0.85,0
SWITCH_B3SL = smd 3 x 1: 1 3,-2; 2 -3,-2; 3 3,2; 4 -3,2
49225-0821 = smd 1.55 x 2.8: CARD_CONNECT_0 6.73,14.1 | smd 1.55 x 2.1: CARD_CONNECT_1 6.73,6.4 | smd 0.8 x 1.8: CD/DAT3 -2.11,16.7; CLK 1.19,16.7; CMD -1.01,16.7; DAT0 3.39,16.7; DAT1 4.49,16.7; DAT2 -3.21,16.7; VDD 0.09,16.7; VSS 2.29,16.7 | smd 1.4 x 2.2: P$3 6.73,1.8; P$4 -7.97,1.25 | smd 1.4 x 3.6: P$5 -8.67,5.75 | smd 1.4 x 3.4: P$6 -8.67,15.3 | smd 1.6 x 1.55: P$7 -5.31,16.425
TINY6410 = drill 0.9 pad 1.422 square: P1.1 -23,-29; P2.1 21,-29 | drill 0.9 pad 1.422 octagon: P1.2 -21,-29; P1.3 -23,-27; P1.4 -21,-27; P1.5 -23,-25; P1.6 -21,-25; P1.7 -23,-23; P1.8 -21,-23; P1.9 -23,-21; P1.10 -21,-21; P1.11 -23,-19; P1.12 -21,-19; P1.13 -23,-17; P1.14 -21,-17; P1.15 -23,-15; P1.16 -21,-15; P1.17 -23,-13; P1.18 -21,-13; P1.19 -23,-11; P1.20 -21,-11; P1.21 -23,-9; P1.22 -21,-9; P1.23 -23,-7; P1.24 -21,-7; P1.25 -23,-5; P1.26 -21,-5; P1.27 -23,-3; P1.28 -21,-3; P1.29 -23,-1; P1.30 -21,-1; P1.31 -23,1; P1.32 -21,1; P1.33 -23,3; P1.34 -21,3; P1.35 -23,5; P1.36 -21,5; P1.37 -23,7; P1.38 -21,7; P1.39 -23,9; P1.40 -21,9; P1.41 -23,11; P1.42 -21,11; P1.43 -23,13; P1.44 -21,13; P1.45 -23,15; P1.46 -21,15; P1.47 -23,17; P1.48 -21,17; P1.49 -23,19; P1.50 -21,19; P1.51 -23,21; P1.52 -21,21; P1.53 -23,23; P1.54 -21,23; P1.55 -23,25; P1.56 -21,25; P1.57 -23,27; P1.58 -21,27; P1.59 -23,29; P1.60 -21,29; P2.2 23,-29; P2.3 21,-27; P2.4 23,-27; P2.5 21,-25; P2.6 23,-25; P2.7 21,-23; P2.8 23,-23; P2.9 21,-21; P2.10 23,-21; P2.11 21,-19; P2.12 23,-19; P2.13 21,-17; P2.14 23,-17; P2.15 21,-15; P2.16 23,-15; P2.17 21,-13; P2.18 23,-13; P2.19 21,-11; P2.20 23,-11; P2.21 21,-9; P2.22 23,-9; P2.23 21,-7; P2.24 23,-7; P2.25 21,-5; P2.26 23,-5; P2.27 21,-3; P2.28 23,-3; P2.29 21,-1; P2.30 23,-1; P2.31 21,1; P2.32 23,1; P2.33 21,3; P2.34 23,3; P2.35 21,5; P2.36 23,5; P2.37 21,7; P2.38 23,7; P2.39 21,9; P2.40 23,9; P2.41 21,11; P2.42 23,11; P2.43 21,13; P2.44 23,13; P2.45 21,15; P2.46 23,15; P2.47 21,17; P2.48 23,17; P2.49 21,19; P2.50 23,19; P2.51 21,21; P2.52 23,21; P2.53 21,23; P2.54 23,23; P2.55 21,25; P2.56 23,25; P2.57 21,27; P2.58 23,27; P2.59 21,29; P2.60 23,29
USB_A_RIGHT_ANGLE = drill 0.9 octagon: 1 -3.5,2.71; 2 -1,2.71; 3 1,2.71; 4 3.5,2.71 | drill 2.3 octagon: CASE -6.57,0; CASE1 6.57,0
MICROMATCH-4_SMD = smd 1.5 x 4.5: 1 1.905,2.794; 2 0.635,-2.794; 3 -0.635,2.794; 4 -1.905,-2.794

### Placement (x,y rotation side)
3V3  34.54,78.23 90 top
5V  30.48,78.23 90 top
ALIM  30.73,10.16 0 top
BAT1  93.25,43.5 270 top
BOOT_SELECT  84.71,77.09 180 top
C1  18.29,22.35 0 top
C3  18.8,29.97 180 top
C4  10.41,48.26 0 top
C5  20.32,47.24 90 top
C6  67.82,66.04 0 top
C7  68.33,63.75 0 top
C8  17.27,10.16 180 bottom
C9  91.1,21.73 270 bottom
C10  17.27,6.1 180 bottom
C11  96.01,21.34 0 bottom
C12  96.52,18.29 0 bottom
C13  69.19,4.3 90 bottom
C14  77.35,36.21 0 top
C15  78.62,24.52 0 top
C16  82.69,24.52 0 top
C17  74.56,28.84 180 top
C18  74.56,31.13 180 top
C19  82.69,4.38 90 bottom
C20  41.59,4.43 90 bottom
C21  55.39,4.51 90 bottom
C22  5.84,26.42 0 bottom
C23  61.6,38.47 0 top
C24  61.6,26.27 0 top
C25  65.66,26.27 0 top
C26  57.53,30.85 180 top
C27  57.55,33.21 180 top
C28  45.21,47 270 top
C29  50.8,49.54 270 top
C30  51.31,46.49 180 top
C31  48.77,43.45 90 top
C32  22.35,52.83 180 top
C33  18.29,52.83 0 top
C34  17.27,54.86 270 bottom
C35  24.38,54.86 270 bottom
C36  20.83,54.1 270 bottom
C37  14.73,54.86 270 bottom
C38  46.23,33.79 180 bottom
C39  51.82,33.79 0 bottom
COLOR/START  5.68,16.64 180 top
COM0  70.61,5.59 0 top
COM1  84.33,5.59 0 top
COM2  43.18,5.59 0 top
COM3  56.9,5.59 0 top
D1  28.96,31.24 180 top
D2  29.21,18.54 0 top
D3  95.5,44.25 0 bottom
E0  62.99,78.23 90 top
E1  58.93,78.23 90 top
E2  54.86,78.23 90 top
E3  50.8,78.23 90 top
E4  46.74,78.23 90 top
E5  42.67,78.23 90 top
E8  38.61,78.23 90 top
E12  67.06,78.23 90 top
H1  5,5 0 top
H2  5,75 0 top
H3  95,75 0 top
H4  95,5 0 top
IC1  14.73,37.59 90 top
IC2  82.18,30.62 0 top
IC3  65.15,32.37 0 top
IC4  48.64,46.37 180 bottom
J1  18.8,69.22 180 top
J2  45.27,66.55 0 top
JP1  89,66 90 top
L1  29.21,43.43 180 top
LAN  6.1,67.56 0 top
LINK  2.54,67.56 0 top
Q1  49.02,37.86 180 bottom
R1  35.56,73.15 270 top
R2  31.5,73.15 270 top
R3  84.71,74.29 180 top
R4  97.41,65.91 270 bottom
R5  94.87,65.91 270 bottom
R6  82.3,70.1 0 top
R7  82.3,67.56 0 top
R8  82.3,62.48 0 top
R9  82.3,65.02 0 top
R10  72.64,66.04 90 top
R11  74.17,69.6 0 top
R12  75.69,66.04 90 top
R13  77.72,68.58 90 top
R14  24.89,16.26 180 bottom
R15  18.8,15.75 180 bottom
R16  18.8,15.75 180 top
R17  23.88,13.72 180 bottom
R18  59.39,53.11 90 top
R19  74.52,22.29 0 top
R20  74.53,19.74 0 top
R21  65.66,44.31 180 bottom
R22  65.66,42.02 180 bottom
R23  70.23,32.88 90 bottom
R24  67.69,32.88 90 bottom
R25  81.16,38.75 90 bottom
R26  78.37,38.75 90 bottom
R27  88.27,31.89 90 bottom
R28  85.73,31.89 90 bottom
R29  91.95,53.34 90 bottom
R30  88.9,53.34 90 bottom
R31  86.36,53.34 90 bottom
R32  83.82,53.34 90 bottom
R33  62.29,52.85 270 top
R34  43.18,41.92 0 bottom
R35  16.26,55.88 90 top
R36  18.8,55.88 90 top
R37  21.84,55.88 90 top
R38  24.38,55.88 90 top
R39  41.4,23.11 180 bottom
R40  41.4,20.83 180 bottom
R41  6.1,62.48 270 top
R42  2.54,62.48 270 top
R43  63.5,73.15 270 top
R44  59.94,73.15 270 top
R45  55.88,73.15 270 top
R46  51.82,73.15 270 top
R47  47.75,73.15 270 top
R48  43.69,73.15 270 top
R49  39.62,73.15 270 top
R50  67.06,73.15 270 top
R51  54.27,72.4 90 bottom
R52  51.73,72.4 90 bottom
R53  49.19,72.4 90 bottom
R54  46.65,72.4 90 bottom
R55  44.11,72.4 90 bottom
R56  41.57,72.4 90 bottom
R57  39.03,72.4 90 bottom
RST  74.42,74.42 0 top
SD1  68.58,79.76 180 bottom
U$1  67.5,36.5 90 top
U$2  16.89,10.41 0 top
X1  5.71,26.67 180 top

### Tracks (layer width: path | path; a pad name or v marks a point on that pad's centre or on a via)
5V_SUPPLY
  Top 0.813: ALIM.4 D2.1 D2.3
+3V3  (via drill 0.6)
  Top 0.254: R12.2 75.69,69.02 R11.2 | R11.2 77.66,69.6 R13.2 | R13.2 77.91,69.53 | R8.2 R9.2 R7.2 R6.2 83.31,70.17 83.31,71.12 82.93,71.5 80,71.5 78.03,69.53 R13.2 | v68.58,61.21 67.38,62.42 C7.1 66.16,64.97 66.16,65.59 C6.1 69.47,69.09 70.55,69.09 | C30.1 52,46.24 52,43.75 50.75,42.5 C31.1 48.77,40.73 v49.25,40.25 | C30.1 52.26,50.24 52,50.5 50.98,50.5 IC4.23 | v55.63,46.23 52.52,46.23 C30.1 | IC4.23 50.93,51.44 51.05,51.56 v52.32,51.56 | IC4.23 50.87,50.56 C29.1 | 45.55,50.49 C28.+ | R11.2 75.12,70.68 74.93,70.87 72.39,70.87 70.61,69.09 70.55,69.09 | 70.55,69.09 R10.2 | R19.2 75.47,19.75 R20.2 | R18.1 61.47,50.18 v61.47,49.28
  Top 0.406: R42.2 R41.2 8.32,61.53 v8.38,61.47 | IC3.16 60.71,38.41 C23.1 60.65,44.64 v63.5,47.5 | IC2.16 77.73,34.56 76.59,35.7 76.59,36.02 C14.1 76.4,43.49 v75.44,44.45 | COM1.4 84.96,1.65 v84.84,2.75 | v38.61,2.75 38.35,3.3 COM2.8 | v57.4,2.75 57.66,2.79 COM3.4 | v66.04,2.75 66.8,2.79 COM0.8 | COM1.8 79.76,2.92 v79.76,2.75 | COM3.8 52.32,2.92 v52.32,2.75 | COM0.4 71.12,2.92 v71.12,2.75 | C5.+ 18.29,42.06 18.29,40.13 19.3,39.12 21.36,39.12 IC1.4 | v35.56,70.36 R1.2 | v9.65,29.46 X1.4 | 13.21,48.26 C4.+ | C6.1 64.01,63.63 v64.01,61.47 | v41.15,50.55 41.2,50.49 45.55,50.49 45.62,50.56 IC4.23 | R19.2 75.44,22.31 v75.44,23.88 | v34.8,24.64 34.29,24.13 34.29,14.48 36.07,12.7 v36.07,3.81 | v43.69,2.75 43.94,2.79 COM2.4 43.69,2.92 v43.69,2.75
  Top 0.61: R41.2 6.1,57.15 2.29,53.34 2.29,47.5 5.08,44.7 9.91,44.7 v11.18,45.97 13.21,48.01 13.21,48.26
  Top 0.813: L1.2 20.98,43.43 C5.+ 16.15,48.26 C4.+
  Bottom 0.254: SD1.VDD 68.58,63.22 v68.58,61.21 | IC4.42 48.9,40.6 v49.25,40.25 | R40.2 42.35,20.39 42.42,20.32 42.42,23.05 R39.2 | C13.1 69.3,3.23 | v55.63,46.23 55.23,46.62 IC4.30 | IC4.23 50.93,51.18 51.31,51.56 v52.32,51.56 | 63.25,47.24 v63.5,47.5 61.72,49.28 v61.47,49.28
  Bottom 0.406: 82.5,2.75 v79.76,2.75 | 82.5,2.75 v84.84,2.75 | 69.3,2.75 v66.04,2.75 | 69.3,2.75 v71.12,2.75 | 55.2,2.75 v52.32,2.75 | 55.2,2.75 v57.4,2.75 | 41.7,2.75 v38.61,2.75 | 41.7,2.75 v43.69,2.75 | R57.2 38.56,73.35 v35.56,70.36 33.53,68.33 33.53,64.22 35.5,62.25 35.5,61.53 35.56,61.47 | C22.1 9.65,29.28 v9.65,29.46 | C20.1 41.7,3.37 41.7,2.75 | 69.3,2.75 69.3,3.23 69.97,3.9 82.2,3.9 82.67,3.43 C19.1 82.5,3.24 82.5,2.75 | C21.1 55.2,3.07 55.2,2.75 | C13.1 68.63,3.9 56.03,3.9 C21.1 | C20.1 42.01,3.9 54.9,3.9 55.24,3.56 C21.1 | 35.56,61.47 v64.01,61.47 | 35.56,61.47 28.96,61.47 24.64,65.79 13.97,65.79 9.65,61.47 v8.38,61.47 | v41.15,50.55 35.56,56.13 35.56,61.47 | v63.5,47.5 72.39,47.5 v75.44,44.45 | D3.A 91.39,42.16 87.63,42.16 85.34,44.45 v75.44,44.45 | v75.44,44.45 v75.44,23.88 | C22.1 6.86,26.35 6.86,21.84 7.62,21.08 10.16,21.08 13.72,24.64 v34.8,24.64 35.05,24.89 41.91,24.89 42.35,24.45 R39.2 | v36.07,3.81 41.26,3.81 C20.1 | C22.1 6.79,28.77 3.56,32 3.56,38.35 v11.18,45.97 13.97,48.77 31.24,48.77 38.1,41.91 38.1,35.31 44.96,28.45 53.34,28.45 61.21,36.32 61.21,45.21 63.25,47.24
  Bottom 0.61: R57.2 R56.2 R55.2 R54.2 R53.2 R52.2 R51.2
+5V  (via drill 0.6)
  Top 0.254: R2.2 32.75,70.95 32.75,53.5 36.5,49.75 36.5,29.46 36.5,28.88 30.67,23.05 30.67,22.5 D2.4
  Top 0.406: C1.+ 21.84,22.35 21.59,22.35
  Top 0.61: v20.32,18.8 20.32,20.83 21.84,22.35
  Top 0.813: D2.4 27.9,22.35 C1.+ 21.95,22.94 C3.+ 20.52,31.39 IC1.1
  Bottom 0.406: U$2.1 13.39,12.64 C8.1 14.12,8.41 C10.+ 12.7,7.52 12.7,11.94 11.68,12.95 11.68,14.73 15.75,18.8 v20.32,18.8
  Bottom 0.61: U$1.P1.1 96.75,13.5 98,14.75 98,17.76 C12.1 97.47,21.28 C11.1 97.5,21.42 97.5,22.75 95.37,24.88 C9.+ 85.52,19.3 36.83,19.3 36.32,19.81 21.34,19.81 v20.32,18.8
AVDD_2V5
  Top 0.406: J1.3 20.71,61.6 J1.4
  Bottom 0.254: C35.1 28.51,55.81 39.5,44.08 IC4.2 45.34,44.08 46.23,44.97 46.24,44.97 46.99,45.72 46.99,46.48 45.84,47.64 IC4.9
  Bottom 0.406: J1.4 17.27,58.17 C34.1 19.24,55.81 19.81,56.39 19.96,56.39 C36.+ 21.23,57.25 22.61,55.88 24.32,55.88 C35.1
COLOR_SELECT_3V3  (via drill 0.6)
  Top 0.254: U$1.P1.59 38.5,13.57 37.08,14.99 v37.08,20.83
  Bottom 0.254: COLOR/START.2 5,13.72 9.65,13.72 16.76,20.83 v37.08,20.83 R40.1
DM9000_RX+
  Top 0.406: J1.1 24.38,61.73 R38.2
  Bottom 0.254: IC4.3 40.01,44.59 26.42,58.93 20.98,58.93 20.73,59.18 20.73,60.86 22.73,62.87 J1.1
DM9000_RX-
  Top 0.406: J1.2 21.98,56.96 R37.2
  Bottom 0.254: IC4.4 40.26,45.1 25.78,60.33 J1.2
DM9000_TX+
  Top 0.254: J1.5 18.17,57.46 R36.2
  Bottom 0.254: IC4.7 41.02,46.62 25.65,61.99 25.65,62.74 23.88,64.52 19.82,64.52 J1.5
DM9000_TX-
  Top 0.406: J1.6 16.9,57.47 R35.2
  Bottom 0.254: IC4.8 41.27,47.13 26.16,62.23 26.16,62.99 24.13,65.02 17.78,65.02 16.9,64.14 J1.6
EINT7
  Bottom 0.254: U$1.P2.40 57.29,60.71 53.85,60.71 53.5,60.25 53.5,56.25 58.42,51.33 58.42,45.97 58.17,45.72 57,44.55 56.13,43.69 54.8,43.69 53.9,44.59 IC4.34
GND  (via drill 0.6)  (1 unrouted)
  Top 0.254: C7.2 69.22,63.81 C6.2 70.36,66.04 v70.87,65.53 | 50.36,45.41 v50.8,44.97 | 50.36,45.41 C30.2 50.36,48.15 C29.2 | 50.36,45.41 49.78,45.41 C31.2 | C31.2 48.77,46.23 v48.01,46.99 | 45.72,43.85 C28.- 45.21,44.4 | C31.2 45.21,44.4 | 45.21,44.4 45.21,45.47 v45.97,46.23 | v91,43.5 BAT1.- | v79.5,45.72 78.3,44.52 C14.2 | JP1.1 90.27,63.48 89,64.75 89,69.5 86.08,72.42 RST.1
  Top 0.406: C17.2 C18.2 73.61,32.46 73.8,32.65 76.34,32.65 77.1,31.89 78.37,31.89 79,32.52 IC2.15 79,35.51 C14.2 | RST.1 RST.2 71.39,72.39 70.36,72.39 | 5V.C 30.45,79.25 32.47,79.25 3V3.C 34.51,79.25 36.54,79.25 E8.C | C33.2 C32.2 21.4,51.48 C5.- 24.49,50.39 v24.64,50.55 | C27.2 56.58,33.19 | C27.2 56.6,34.24 57.4,35.04 58.93,35.04 | C23.2 62.55,37.18 61.98,36.61 IC3.15 61.98,34.11 61.17,33.3 60.67,33.3 58.93,35.04 | COM1.1 88.65,8.38 v88.9,8.13 | v83.82,8.13 83.44,8.13 COM1.5 | v75.18,8.13 75.31,8.13 COM0.1 | COM0.5 70.36,8.38 v70.1,8.13 | COM3.1 61.21,8.38 v61.47,8.13 | COM3.5 56.13,8.38 v56.39,8.13 | COM2.1 47.5,8.38 v47.75,8.13 | COM2.5 42.42,8.38 v42.67,8.13 | IC1.6 IC1.3 | IC1.5 20.98,41 22.35,39.62 22.35,37.59 | R16.1 20.39,15.1 U$2.4 | E8.C 38.58,79.25 40.6,79.25 E5.C 42.64,79.25 44.67,79.25 E4.C 46.71,79.25 48.73,79.25 E3.C 50.77,79.25 52.79,79.25 E2.C 54.83,79.25 56.86,79.25 E1.C 58.9,79.25 60.92,79.25 E0.C 62.96,79.25 64.99,79.25 E12.C 67.03,79.25 69.08,79.25 69.34,78.99 | v2.29,23.62 3.56,23.62 X1.1 | E8.C 37.56,69.82 36.38,68.64 J2.8 | 69.34,78.99 69.34,73.41 70.36,72.39 | 69.34,78.99 69.6,79.25 90.75,79.25 H3.B3,3 | H1.B3,3 5,12.1 5.7,12.8 5.7,16.62 COLOR/START.1 | 70.36,72.39 67.25,69.28 v67.25,68.25 | 58.93,35.04 v58.93,36.32 | U$1.P1.2 96.5,25.17 v92.71,28.96 89.66,32 89.66,42.93 90.24,43.5 v91,43.5 | v47.24,22.1 47.24,26.16 v47.5,26.42 52.14,26.42 C26.2 56.6,30.87 C27.2 | v28.96,36.07 28.45,36.07 | H3.B3,3 99.31,70.69 99.31,49.53 95.57,45.79 BAT1.- | R3.1 85.7,74.25 87.5,74.25 88.25,75 H3.B3,3
  Top 0.61: C5.- 20.47,50.39 22.35,48.51 24.89,48.51 27.43,45.97 27.43,39.9 25.13,37.59 | U$2.4 14.89,7.62 7.62,7.62 H1.B3,3
  Top 0.813: v88.9,8.13 91.87,8.13 H4.B3,3 98.55,8.55 98.55,14.22 97.28,15.5 U$1.P1.2 | D1.1 D1.3 25.13,37.59 22.35,37.59 IC1.3 | C4.- 8.13,48.26 10.67,50.8 19.91,50.8 C5.- | IC1.6 15.65,34.14 C3.- 14.04,28.36 C1.- 14.04,17.85 5.08,8.89 5.08,5.08 H1.B3,3 30.65,5 32,6.35 ALIM.2
  Bottom 0.254: SD1.VSS 70.87,65.27 v70.87,65.53 | R34.1 44.38,42.18 IC4.48 IC4.47 46.35,43.35 46.5,43.5 47.25,43.5 47.37,43.38 47.37,43.25 | IC4.33 50.93,45.1 v50.8,44.97 | C39.2 C38.2 47.25,33.72 47.25,32.75 47,32.5 44,32.5 40.75,35.75 40.75,38.75 41.5,39.5 46.5,39.5 47.37,40.37 IC4.45 47.37,43.25 | IC4.41 49.4,43.35 49.25,43.5 48.01,43.5 | 48.01,43.5 47.62,43.5 47.37,43.25 | COLOR/START.1 COLOR/START.3 | 48.01,43.5 v48.01,46.99 46.86,48.13 IC4.15 | IC4.5 IC4.6 45.86,46.11 v45.97,46.23 | v91,43.5 91,51.44 R29.1 R30.1 R31.1 R32.1 79.5,48.07 v79.5,45.72
  Bottom 0.406: 21.46,51.44 20.98,50.95 C36.- 17.87,53.91 C34.2 C37.2 | 21.46,51.44 23.37,53.34 23.81,53.34 C35.2 | C10.- 20.42,8.41 C8.2 20.39,11.88 U$2.4 22.33,13.12 R17.1 | v88.9,8.13 v83.82,8.13 82.87,7.18 82.87,5.51 C19.2 82.6,5.25 C13.2 | v75.18,8.13 v70.1,8.13 69.15,7.18 69.15,5.28 arc90 C13.2 | v61.47,8.13 v56.39,8.13 55.44,7.18 C21.2 | v47.75,8.13 v42.67,8.13 41.59,7.04 C20.2 | v2.29,23.62 2.29,25.4 3.3,26.42 C22.2 4.89,22.93 4.18,22.21 COLOR/START.1 | v24.64,50.55 22.35,50.55 21.46,51.44 | SD1.CARD_CONNECT_1 80.19,78.49 91.51,78.49 H3.B3,3 | ALIM.2 32,6.86 33.48,5.38 C20.2 | C21.2 55.17,5.38 C20.2 | C13.2 69.1,5.16 55.69,5.16 C21.2 | v70.87,65.53 70.22,65.53 67.5,68.25 v67.25,68.25 | v58.93,36.32 54.36,32 51.19,32 50.87,32.32 C39.2 | v92.71,28.96 91.19,28.96 88.65,26.42 88.65,24.38 84.58,20.32 49.02,20.32 v47.24,22.1 | v47.5,26.42 46.48,27.43 40.89,27.43 32.26,36.07 v28.96,36.07
  Bottom 0.61: U$1.P1.2 95.57,16.43 C12.2 94.61,19.25 | 94.61,19.25 C11.2 | C9.- 93.95,18.58 94.61,19.25
  Bottom 0.813: H2.B3,3 5,61.29 12.38,53.91 C37.2
  pour Top: 100,0 100,80 0,80 0,0
  pour Bottom: 100,0 100,80 0,80 0,0
LADDR2
  Top 0.254: R33.1 62.29,55.71 U$1.P2.37
LAN_LED  (via drill 0.6)
  Top 0.254: v59.25,41.25 54,36 v54,30.75 | v27.75,54.75 27.75,61.15 22.65,66.25 22.5,66.25 16.25,66.25 13.25,63.25 10,63.25 8.5,64.75 8.5,67.25 7.14,68.61 LAN.C
  Bottom 0.254: IC4.39 50.42,41.33 51,40.75 58.75,40.75 v59.25,41.25 | v54,30.75 44.75,30.75 39.75,35.75 39.75,42.75 37,45.5 37,45.75 28,54.75 v27.75,54.75
LDATA0
  Bottom 0.254: U$1.P2.45 52.5,56.5 48.5,52.5 48.39,52.39 IC4.18
LDATA1
  Bottom 0.254: U$1.P2.46 51.5,58.5 51.5,56.25 48,52.75 47.88,52.63 IC4.17
LDATA2
  Bottom 0.254: IC4.16 47.37,53.12 47.5,53.25 50.5,56.25 U$1.P2.47
LDATA3
  Bottom 0.254: IC4.14 46.35,52.85 46.5,53 49.5,56 49.5,58.5 U$1.P2.48
LDATA4
  Bottom 0.254: IC4.13 45.85,53.1 46,53.25 48.5,55.75 U$1.P2.49
LDATA5
  Bottom 0.254: IC4.12 44.45,52.45 44.5,52.5 47.5,55.5 47.5,58.5 U$1.P2.50
LDATA6
  Bottom 0.254: U$1.P2.51 46.5,55.25 43,51.75 43,49 43.35,48.65 IC4.11
LDATA7
  Bottom 0.254: U$1.P2.52 45.5,58.5 45.5,55 42.5,52 42.5,48.75 43.1,48.15 IC4.10
LDATA8  (via drill 0.6)
  Top 0.254: U$1.P2.53 44.5,56.25 45,55.75 54,55.75 59,50.75 59,47 57.36,45.36 v56.53,45.36
  Bottom 0.254: v56.53,45.36 55.02,45.36 54.27,46.11 IC4.31
LDATA9  (via drill 0.6)
  Top 0.254: U$1.P2.54 43.5,58.5 43.5,55.5 43.75,55.25 53.75,55.25 58.25,50.75 58.25,47.5 57.5,46.75 v57.27,46.75
  Bottom 0.254: v57.27,46.75 56.51,46.75 56.13,47.13 IC4.29
LDATA10  (via drill 0.6)
  Top 0.254: U$1.P2.55 42.5,55.25 43,54.75 53.5,54.75 57.75,50.5 57.75,48.5 57.25,48 v56.76,48
  Bottom 0.254: IC4.28 55.23,47.64 55.59,48 v56.76,48
LDATA11  (via drill 0.6)
  Top 0.254: U$1.P2.56 41.5,58.5 41.5,54.5 41.75,54.25 53.25,54.25 57.25,50.25 57.25,49.5 56.75,49 55.25,49 v54.75,48.5
  Bottom 0.254: IC4.27 54.4,48.15 v54.75,48.5
LDATA12  (via drill 0.6)
  Top 0.254: U$1.P2.57 40.5,54.75 41.5,53.75 53,53.75 56,50.75 v56,50
  Bottom 0.254: IC4.26 53.72,48.65 54.56,49.5 55.56,49.5 v56,50
LDATA13  (via drill 0.6)
  Top 0.254: U$1.P2.58 39.5,58.5 39.5,55 41.25,53.25 52.75,53.25 54.75,51.25 v54.75,50.5
  Bottom 0.254: IC4.25 53.41,49.16 v54.75,50.5
LDATA14  (via drill 0.6)
  Top 0.254: U$1.P2.59 38.5,55.25 41,52.75 52.5,52.75 53.5,51.75 v53.5,50.5
  Bottom 0.254: IC4.24 53.44,50.56 v53.5,50.5
LDATA15  (via drill 0.6)
  Top 0.254: U$1.P2.60 37.25,58.25 37.25,55.75 41.18,51.82 v49.28,51.82
  Bottom 0.254: IC4.22 50.42,51.42 50.02,51.82 v49.28,51.82
LINK_LED  (via drill 0.6)
  Top 0.254: LINK.C 3.78,69.85 6.9,69.85 9,67.75 9,65 10.25,63.75 13,63.75 16,66.75 23,66.75 29,60.75 v29,52.25 | v53,29.75 53,36.5 v59.25,42.75
  Bottom 0.254: IC4.38 50.93,41.57 51.25,41.25 55.75,41.25 57.75,41.25 v59.25,42.75 | v29,52.25 39,42.25 39,35.75 45,29.75 v53,29.75
LNOE  (via drill 0.6)
  Top 0.254: U$1.P2.44 55.5,58.5 55.5,55.5 v57,54
  Bottom 0.254: IC4.35 53.66,44.08 54.56,43.18 56.39,43.18 57.5,44.29 58.17,44.96 58.93,45.72 58.93,52.07 v57,54
LNWE
  Bottom 0.254: U$1.P2.43 56.75,55.25 57.25,55.25 59.44,53.06 59.44,45.47 58.67,44.7 58,44.03 56.64,42.67 54.32,42.67 53.42,43.57 IC4.36
N$1
  Top 0.254: RST.4 RST.3 | RST.3 77.95,76.42 77.98,76.45 77.45,76.45 RST.3 | RST.3 79.28,76.42 80.95,74.75 | U$1.P2.3 93.5,58.5 93.5,69.5 90,73 82.7,73 80.95,74.75 | 80.95,74.75 81,74.75
N$2
  Top 0.406: 3V3.A 35.59,74.14 R1.1
N$3
  Top 0.406: 5V.A 31.53,74.14 R2.1
N$4
  Top 0.406: R3.2 82.71,74.29 82.17,74.83 BOOT_SELECT.3
N$5
  Bottom 0.406: U$1.P2.2 96.5,60.47 94.87,62.1 R5.2
N$6
  Bottom 0.406: R4.2 98.55,63.82 98.55,58.42 97.63,57.5 U$1.P2.1
N$7
  Bottom 0.254: 94.87,66.93 94.94,66.86 R4.1
  Bottom 0.406: BOOT_SELECT.1 94.87,66.93 R5.1
N$8
  Top 0.254: R13.1 77.72,65.02 73.5,60.8 73.5,58.5 U$1.P2.25
  Bottom 0.254: SD1.DAT0 71.97,64.6 72.14,64.77 73.66,64.77 74.17,64.26 74.17,61.47 73.5,60.8 73.5,58.5 U$1.P2.25
N$9
  Top 0.254: U$1.P2.26 72.5,61.9 R12.1
  Bottom 0.254: SD1.DAT1 73.07,61.28 72.5,60.71 U$1.P2.26
N$10
  Top 0.813: IC1.2 23.55,35.89 24.38,35.05 24.38,33.53 26.92,30.99 26.92,30.77 D1.4 28.96,29.46 29.97,30.48 32.51,30.48 34.16,32.13 L1.1
N$11
  Top 0.254: R11.1 73.22,68.51 73.91,67.82 73.91,64.01 71.5,61.59 71.5,58.5 U$1.P2.27
  Bottom 0.254: SD1.DAT2 65.37,60.63 65.5,60.5 65.5,58.75 65.75,58.5 67.25,58.5 67.5,58.25 67.5,56.75 68,56.25 69.25,56.25 U$1.P2.27
N$12
  Top 0.254: U$1.P2.28 70.5,62.95 R10.1
  Bottom 0.254: U$1.P2.28 69.25,58.5 68,58.5 67.5,59 67.5,60.5 66.47,61.53 SD1.CD/DAT3
N$13
  Top 0.254: U$1.P2.22 76.5,60.2 | 76.5,60.2 76.5,60.24 | R9.1 80.01,65.02 76.5,61.51 76.5,60.2
  Bottom 0.254: SD1.CMD 67.57,65.68 66.25,67 66.25,68.79 66.96,69.5 76.3,69.5 78.23,67.56 78.23,62.74 76.5,61.01 U$1.P2.22
N$14
  Top 0.254: R8.1 79.76,62.48 77.5,60.23 77.5,58.5 U$1.P2.21
  Bottom 0.254: SD1.CLK 69.77,62.06 71.5,60.25 71.5,57 72.37,56.13 75.13,56.13 U$1.P2.21
N$15
  Top 0.254: R7.1 79.76,65.97 79.76,65.53 75.5,61.28 75.5,58.5 U$1.P2.23
  Bottom 0.254: SD1.CARD_CONNECT_0 75.31,61.44 75.5,61.25 75.5,60.5 75.5,58.5 U$1.P2.23
N$16
  Top 0.254: R6.1 80.26,70.1 79.25,69.09 79.25,65.79 74.5,61.04 U$1.P2.24
N$17
  Top 0.61: U$2.2 15.89,13.79 R15.1
  Bottom 0.61: R15.1 15.89,13.79 U$2.2
N$18
  Bottom 0.254: R17.2 24.83,14.8 24.38,15.24 24.38,15.81 R14.1 22.86,16.26 20.83,14.22 19.3,14.22 18.2,13.12 U$2.3
N$19
  Bottom 0.254: 25.91,16.26 31.5,16.26 32.51,17.27 62.73,17.27 U$1.P1.34
  Bottom 0.406: R14.2 25.91,16.26
N$20
  Top 0.406: IC2.1 77.73,24.52 C15.1
N$21
  Top 0.254: U$1.P2.41 59.29,54.71 59.29,53.96 R18.2
N$22
  Top 0.406: C15.2 80.27,25.23 IC2.3
N$23
  Top 0.406: C16.1 81.54,24.72 IC2.4
N$24
  Top 0.406: C16.2 83.45,24.71 83.45,25.54 82.81,26.18 IC2.5
N$25
  Top 0.406: IC2.6 84.08,28.97 83.7,29.36 80.14,29.36 78.37,31.13 C18.1
N$26
  Top 0.406: C17.1 76.59,28.84 77.1,29.35 78.37,29.35 79,28.71 IC2.2
N$27
  Top 0.406: IC3.1 60.71,26.34 C24.1
N$28
  Top 0.406: IC3.3 63.25,26.98 C24.2
N$29
  Top 0.406: IC3.4 64.52,26.47 C25.1
N$30
  Top 0.406: IC3.5 65.79,28.18 66.42,27.55 66.42,26.47 C25.2
N$31
  Top 0.406: C26.1 59.47,30.85 59.92,31.3 61.42,31.3 61.98,30.74 IC3.2
N$32
  Top 0.406: C27.1 59.26,33.21 60.17,32.3 61.67,32.3 62.67,31.3 66.67,31.3 67.06,30.91 IC3.6
N$33  (via drill 0.6)
  Top 0.254: R33.2 62.23,51.56 62.23,50.55 62.74,50.04 62.74,48.74 58.58,44.58 v55.37,44.58
  Bottom 0.254: IC4.32 53.96,45.6 54.99,44.58 v55.37,44.58
N$34
  Bottom 0.254: IC4.1 42.8,43.57 42.16,42.94 42.16,41.99 R34.2
N$35
  Top 0.406: R37.1 22.03,54.93 23.11,53.85 | 23.11,53.85 23.11,53.02 C32.1 | 23.11,53.85 24.2,54.93 R38.1
N$36
  Top 0.406: C33.1 17.34,53.85 | 17.34,53.85 R35.1 | R36.1 18.42,54.93 17.34,53.85
N$37
  Bottom 0.254: IC4.43 48.39,39.61 50.25,37.75 50.5,37.75 53.74,37.75 Q1.2 53.85,34.88 C39.1
N$38
  Bottom 0.254: IC4.44 47.88,39.88 46.25,38.25 44.59,38.25 Q1.1 44.2,34.88 C38.1
N$39
  Top 0.406: R41.1 LAN.A
N$40
  Top 0.406: R42.1 LINK.A
N$41  (1 unrouted)
  Top 0.254: U$1.P2.32 65.5,58.5 65.5,55.75 67,54.25 79.75,54.25 81.5,56 81.5,60 82.25,60.75 90.5,60.75 92,62.25 92,64.27 JP1.3
N$42
  Bottom 0.406: C37.1 14.36,56.19 J1.8
N$43  (via drill 0.6)
  Top 0.406: BAT1.+ v98,35 | BAT1.'+ 97.49,52.01 v97.75,51.75 98.5,52.5 98.5,60 97.5,61 96,61 U$1.P2.4
  Bottom 0.406: v98,35 97.75,35.25 97.53,35.25 D3.C 97.75,44.25 v97.75,51.75
N$44
  Top 0.406: E0.A 64.04,74.64 R43.1
N$45
  Top 0.406: E1.A 59.98,74.14 R44.1
N$46
  Top 0.406: E2.A 55.91,74.14 R45.1
N$47
  Top 0.406: E3.A 51.85,74.14 R46.1
N$48
  Top 0.406: E4.A 47.79,74.14 R47.1
N$49
  Top 0.406: E5.A 43.72,74.14 R48.1
N$50
  Top 0.406: E8.A 39.66,74.14 R49.1
N$51
  Top 0.406: E12.A 68.11,75.15 R50.1
N$52
  Top 0.406: U$1.P2.34 61.98,62.02 61.98,65.79 67.06,70.87 R50.2
N$53  (via drill 0.6)
  Top 0.254: J2.7 38.92,64.32 38.35,63.75 36.32,63.75 33.53,60.96 33.53,53.59 37.08,50.04 37.08,24.59 35.56,23.06 v35.56,18.8
  Top 0.406: R49.2 38.92,71.5 J2.7
  Bottom 0.254: v35.56,18.8 35.81,18.54 65.46,18.54 U$1.P1.30
  Bottom 0.406: R57.1 38.92,71.34 J2.7
N$54
  Top 0.254: J2.6 41.46,63.81 40.89,63.25 36.58,63.25 34.04,60.71 34.04,53.85 37.59,50.29 37.59,33.78 40.5,30.87 U$1.P1.58
  Top 0.406: R48.2 41.46,69.97 J2.6
  Bottom 0.406: R56.1 41.46,71.34 J2.6
N$55
  Top 0.254: J2.5 44,63.3 43.43,62.74 36.83,62.74 34.54,60.45 34.54,54.1 38.1,50.55 38.1,34.04 41.27,30.86 41.5,30.64 41.5,14.5 U$1.P1.57
  Top 0.406: R47.2 47.56,72.2 44,68.64 J2.5
  Bottom 0.406: R55.1 44,71.34 J2.5
N$56
  Top 0.254: J2.4 46.54,62.8 45.97,62.23 37.08,62.23 35.05,60.2 35.05,54.36 38.61,50.8 38.61,34.29 42.5,30.4 U$1.P1.56
  Top 0.406: R46.2 51.82,71.12 51.05,70.36 48.51,70.36 46.48,68.33 46.48,66.61 J2.4
  Bottom 0.406: R54.1 46.54,71.34 J2.4
N$57
  Top 0.254: J2.3 49.08,62.54 48.26,61.72 37.34,61.72 35.56,59.94 35.56,54.61 39.12,51.05 39.12,34.54 43.18,30.48 43.5,30.16 43.5,14.5 U$1.P1.55
  Top 0.406: R45.2 55.88,70.87 54.61,69.6 50.55,69.6 49.02,68.07 49.02,66.61 J2.3
  Bottom 0.406: R53.1 49.08,71.34 J2.3
N$58
  Top 0.254: J2.2 51.62,61.78 51.05,61.21 37.59,61.21 36.07,59.69 36.07,54.86 39.62,51.31 39.62,34.8 44.5,29.92 44.5,27.18 | U$1.P1.54 44.5,27.18 | 44.5,27.18 44.5,27.48
  Top 0.406: R44.2 56.58,68.83 52.58,68.83 51.56,67.82 51.56,66.61 J2.2
  Bottom 0.406: R52.1 51.62,71.34 J2.2
N$59
  Top 0.254: J2.1 54.16,62.03 52.83,60.71 37.85,60.71 36.58,59.44 36.58,55.12 40.13,51.56 40.13,35.05 45.34,29.84 45.5,29.68 45.5,14.5 U$1.P1.53
  Top 0.406: R43.2 57.85,66.55 J2.1
  Bottom 0.406: R51.1 54.16,71.34 J2.1
N$60
  Bottom 0.254: U$1.P2.33 64.5,53.75 65.38,52.88 65.5,52.75 67,51.25 78.75,51.25 83.5,56 83.5,60.5 84.25,61.25 91.5,61.25 92.75,62.5 92.75,67.5 91.75,68.5 90.31,68.5 JP1.5
N$61  (2 unrouted)
  Bottom 0.254: U$1.P2.31 66.5,54.25 68.75,52 79.75,52 81.5,53.75 81.5,60.75 85.5,64.75 88.5,64.75 89,65.25 89,67.75 88.21,68.54 JP1.6 87.69,68.5
N$62  (via drill 0.6)  (3 unrouted)
  Top 0.254: U$1.P2.30 69.5,58.5 69.5,56.75 71,55.25 76.75,55.25 v77.25,55.75
  Bottom 0.254: v77.25,55.75 77.5,56 77.5,60.75 82.75,66 JP1.4
N$63
  Top 0.254: JP1.2 85.52,61.25 80.5,61.25 79.5,60.25 79.5,55.25 79,54.75 69,54.75 68.5,55.25 U$1.P2.29
NCS1
  Bottom 0.254: U$1.P2.39 58.5,55.29 59.94,53.85 59.94,45.21 58.93,44.2 58.5,43.75 56.93,42.18 IC4.37
NRESET
  Bottom 0.254: U$1.P2.42 57.5,58.5 59.25,58.5 59.5,58.25 59.5,55.05 60.45,54.1 60.45,41.2 59.5,40.25 50.75,40.25 49.91,41.09 IC4.40
RX0_3V3  (via drill 0.6)
  Top 0.254: U$1.P2.8 91.5,58.5 91.5,55.75 86.62,50.87 v86.62,38.49 IC2.9
  Bottom 0.254: R27.2 88.27,36.84 v86.62,38.49
RX0_232  (via drill 0.6)
  Top 0.254: IC2.8 86.62,25.41 v87,25.03 87.5,24.54 87.5,12.57 87.12,12.19 85.85,12.19 84.84,11.18 74.17,11.18 73.79,10.79 COM0.2
  Bottom 0.254: v87,25.03 87,26.3 88.27,27.57 R27.1
RX1_3V3  (via drill 0.6)
  Top 0.254: U$1.P2.10 87.5,58.5 87.5,55 82.69,50.19 v82.69,39.76 82.81,39.64 IC2.12
  Bottom 0.254: v82.69,39.76 81.23,39.76 R25.2
RX1_232  (via drill 0.6)
  Top 0.254: v81.67,35.7 81.54,35.57 IC2.13 81.54,32.33 83.25,30.62 87.5,30.62 93.5,24.62 93.5,19.5 93.5,11.71 92.96,11.18 87.88,11.18 87.5,10.79 COM1.2
  Bottom 0.254: v81.67,35.7 81.67,37.29 R25.1
RX2_3V3  (via drill 0.6)
  Top 0.254: U$1.P2.12 85.5,58.5 85.5,56.5 70.25,41.25 69.25,41.25 67.23,39.23 v67.18,39.23 | IC3.9 69.6,38.85 v69.22,39.23
  Bottom 0.254: v67.18,39.23 v69.22,39.23 70.23,38.21 R23.2
RX2_232  (via drill 0.6)
  Top 0.254: IC3.8 69.6,27.16 v70.23,26.53 70.23,25.5 68.23,23.5 65.59,23.5 65,23.5 59.5,18 59.5,12.76 57.91,11.18 46.74,11.18 46.35,10.79 COM2.2
  Bottom 0.254: v70.23,26.53 R23.1
RX3_3V3  (via drill 0.6)
  Top 0.254: U$1.P2.14 83.5,58.5 83.5,56 71.75,44.25 v69.72,44.25 69.67,44.25 65.79,40.37 | IC3.12 65.79,37.66 65.15,38.3 65.15,39.74 65.79,40.37 | 65.79,40.37 66.17,40.75
  Bottom 0.254: R21.2 69.67,44.31 arc-90 v69.72,44.25
RX3_232  (via drill 0.6)
  Top 0.254: COM3.2 60.07,10.79 60.45,11.18 62.23,11.18 63.5,12.45 63.5,19.75 65.75,22 69,22 72.26,25.26 72.26,31.61 70.49,33.39 65.41,33.39 64.52,34.27 IC3.13 64.52,42.4 v62.61,44.31
  Bottom 0.254: v62.61,44.31 R21.1
SCL_3V3  (via drill 0.6)  (1 unrouted)
  Top 0.254: X1.2 v5.08,33.02 | v63.25,1.52 63.25,9.25 65.5,11.5 65.5,17 v71.52,23.02 72.84,23.02 R19.1 | v70.5,46.25 v77.5,53.25
  Top 0.406: COM2.6 41.27,1.65 v41.15,1.52 | v54.86,1.52 54.86,2.67 COM3.6 | v68.58,1.52 68.58,2.67 COM0.6 | v82.3,1.52 82.3,2.67 COM1.6
  Bottom 0.254: v5.08,33.02 9.4,33.02 15.75,26.67 45.47,26.67 49.87,22.27 50.25,22.25 70.75,22.25 v71.52,23.02 72,23.5 72,44 70.5,45.5 v70.5,46.25 | v77.5,53.25 78.5,54.25 U$1.P2.19
  Bottom 0.406: v82.3,1.52 v68.58,1.52 v63.25,1.52 v54.86,1.52 v41.15,1.52
SDA_3V3  (via drill 0.6)
  Top 0.254: COM3.7 53.47,8.64 | X1.3 9.58,23.88 v9.6,23.9 | COM0.7 67.44,11.44 67.5,11.5 67.5,17.25 v71.75,21.5 71.82,21.5 R20.1 | v71.75,45.75 72.25,45.75 79.25,52.75 v79.25,53.25
  Top 0.406: COM2.7 40.13,8.51 40.13,10.16 v38.61,10.16 | v52.32,10.16 53.72,10.16 COM3.7 | v66.04,10.16 67.44,10.16 COM0.7 | v79.76,10.16 81.15,10.16 COM1.7
  Bottom 0.254: v38.61,10.16 v52.32,10.16 v66.04,10.16 v79.76,10.16 | v9.6,23.9 11.86,26.16 45.21,26.16 49.87,21.5 v71.75,21.5 73,22.75 73,44.5 v71.75,45.75 | U$1.P2.20 79.5,58.5 79.5,53.5 v79.25,53.25
STARTING_CORD_3V3  (via drill 0.6)
  Top 0.254: U$1.P1.60 38.5,22.97 v38.35,23.11
  Bottom 0.254: R39.1 v38.35,23.11 18.29,23.11 9.57,14.4 7.92,14.4 COLOR/START.4
TX0_3V3  (via drill 0.6)
  Top 0.254: U$1.P2.7 90.5,55.8 85.35,50.66 v85.35,36.97 IC2.10
  Bottom 0.254: R29.2 90.5,55.74 U$1.P2.7 | R28.2 85.35,33.22 v85.35,36.97
TX0_232  (via drill 0.6)
  Top 0.254: IC2.7 85.35,24.4 v85.99,23.76 85.99,18.49 83.5,16 83.5,12.38 82.8,11.68 73.15,11.68 72.52,11.05 COM0.3
  Bottom 0.254: v85.99,23.76 85.99,30.69 R28.1
TX1_3V3  (via drill 0.6)
  Top 0.254: IC2.11 v84.08,41.8 84.08,50.58 88.5,55 U$1.P2.9
  Bottom 0.254: R30.2 88.5,54.69 U$1.P2.9 | v84.08,41.8 83.83,42.05 79.89,42.05 78.37,40.53 R26.2
TX1_232  (via drill 0.6)
  Top 0.254: v80.15,35.7 80.27,35.57 IC2.14 80.27,32.1 82.25,30.12 87.25,30.12 91.5,25.87 91.5,15.75 | COM1.3 86.23,11.05 86.87,11.68 90.93,11.68 91.5,12.25 91.5,15.75 | 91.5,15.75 91.5,16.82
  Bottom 0.254: v80.15,35.7 80.15,36.02 R26.1
TX2_3V3  (via drill 0.6)
  Top 0.254: U$1.P2.11 86.5,56 86.25,55.75 85.5,55.75 70.5,40.75 69.5,40.75 68.33,39.58 v68.33,37.96 IC3.10
  Bottom 0.254: R31.2 86.5,54.43 U$1.P2.11 | R24.2 67.69,37.32 v68.33,37.96
TX2_232  (via drill 0.6)
  Top 0.254: IC3.7 68.33,26.66 v68.45,26.53 68.45,25 67.7,24.25 64.4,24.25 64.25,24.25 57.5,17.5 57.5,12.29 56.9,11.68 45.72,11.68 45.09,11.05 COM2.3
  Bottom 0.254: v68.45,26.53 67.69,27.29 R24.1
TX3_3V3  (via drill 0.6)
  Top 0.254: U$1.P2.13 84.5,56.25 71.03,42.78 v69.47,42.78 69.22,42.78 66.3,39.86 | IC3.11 67.06,37.4 65.91,38.54 65.91,39.48 66.3,39.86 | 66.3,39.86 66.68,40.24
  Bottom 0.254: R32.2 84.5,54.97 U$1.P2.13 | R22.2 68.71,42.02 v69.47,42.78
TX3_232  (via drill 0.6)
  Top 0.254: 59.18,11.43 58.93,11.18 | 59.18,11.43 59.44,11.68 60.68,11.68 61.5,12.5 | COM3.3 58.8,11.05 59.18,11.43 | 61.5,12.5 61.5,12.06 | v62.61,42.02 63.88,40.75 63.88,37.45 63.25,36.81 IC3.14 63.25,34.02 64.39,32.88 69.98,32.88 71.5,31.35 71.5,25.75 68.5,22.75 65.25,22.75 61.5,19 61.5,12.5
  Bottom 0.254: v62.61,42.02 R22.1
USBDN
  Bottom 0.254: R15.2 21.78,17.78 64.22,17.78 U$1.P1.32